# EasyEDA Pro project ConversorBUCK.eprj

# Schematic CIRCUITO
Board Name: Board1; Create Date: 2026-05-22; Page Name: P1; Project Name: ConversorBUCK; Schematic Name: CIRCUITO; Update Date: 2026-06-01; Company: EasyEDA.com; Page Size: A4; Version: V1.0
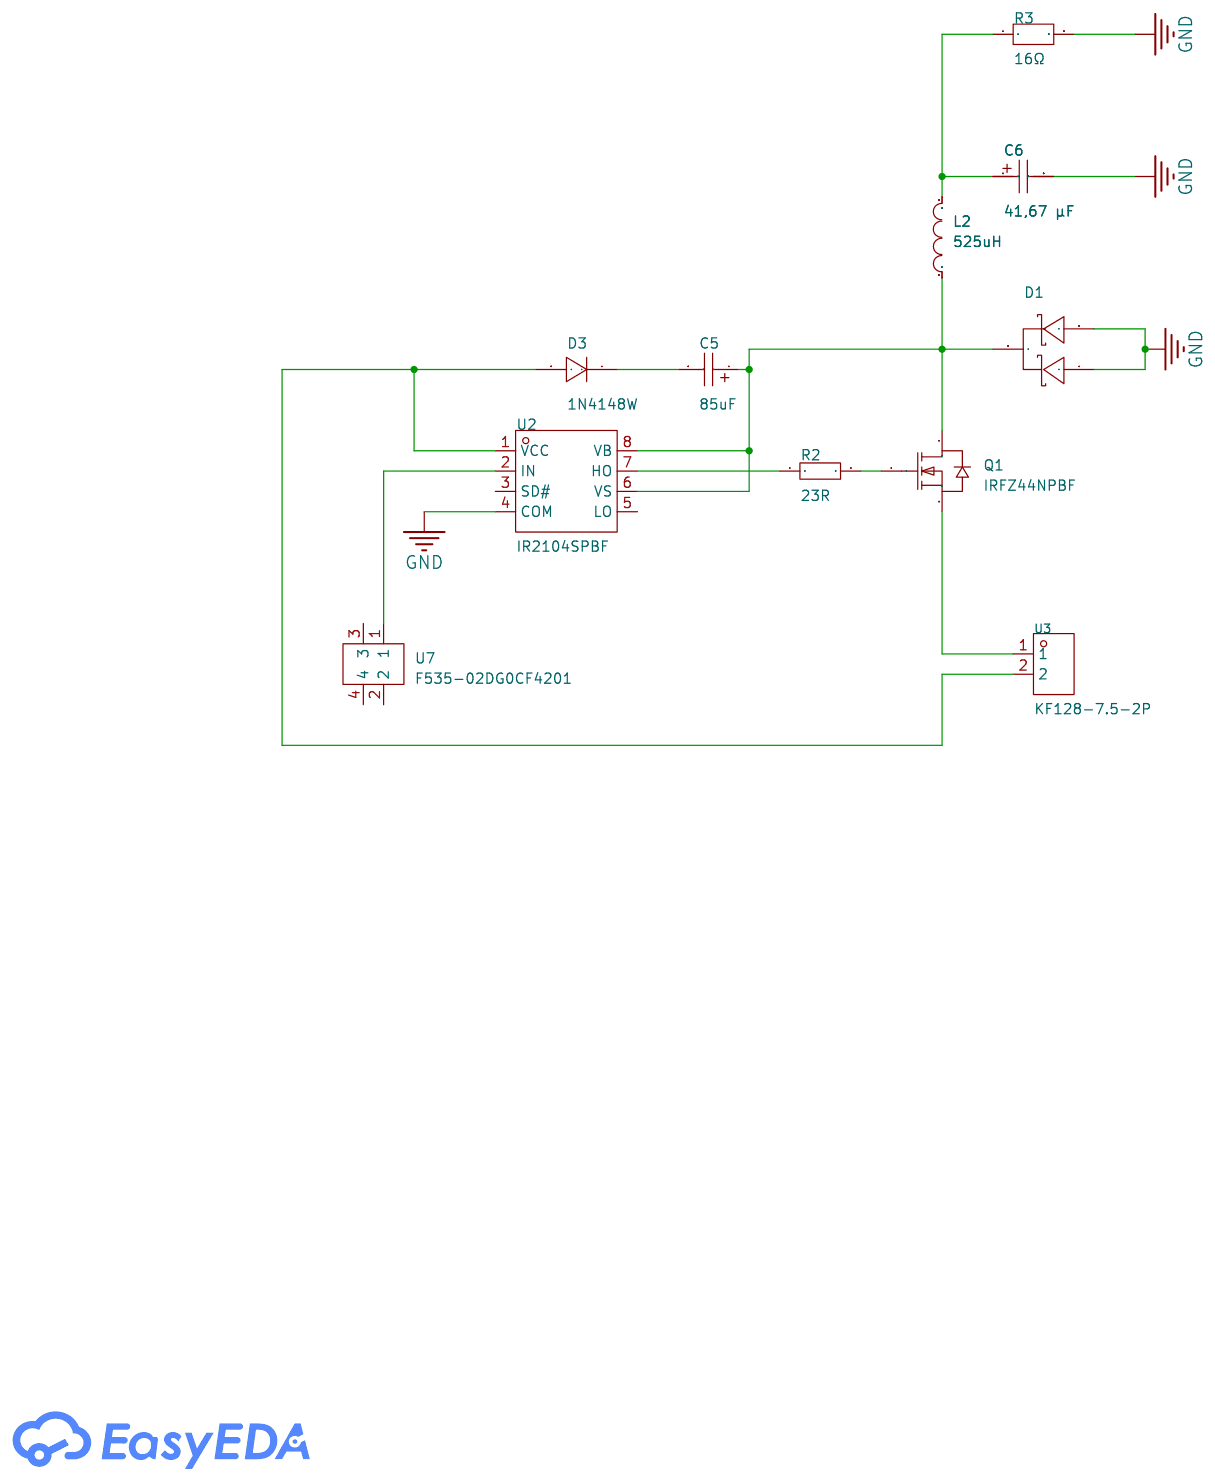
[diagram p0: schematic sheet]

## Parts
C5  85uF  [CAP-SMD_BD4.0-L4.3-W4.3-FD]
C6  41,67 µF  [CAP-SMD_BD4.0-L4.3-W4.3-FD]
D1  MBR2045CT  [TO-220AB-3_L10.4-W4.6-P2.54-T]
D3  1N4148W  [SOD-123F_L2.7-W1.6-LS3.8-RD]
L2  525uH  [L1206]
Q1  IRFZ44NPBF  [TO-220AB-3_L10.4-W4.6-P2.54-L]
R2  23R  [R0603]
R3  16Ω  [RES-TH_L20.3-W19.0-P27.00_AHA10]
U2  IR2104SPBF  [SOIC-8_L4.9-W3.9-P1.27-LS6.0-BL]
U3  KF128-7.5-2P  [CONN-TH_P7.50_KF128-7.5-2P]
U7  F535-02DG0CF4201  [HDR-TH_4P-P2.54-V-F-R2-C2-S2.54]

## Library data of the parts
C5 C6 = C_Ele_SMD_4x5.5mm: Supplier Footprint: SMD,4x5.5mm
D1 = MBR2045CT: LCSC Part Name: 电压:45V 电流:10A; Supplier Part: C360496; Manufacturer: PINGWEI(平伟); Supplier Footprint: TO-220AB-3; JLCPCB Part Class: Extended Part; Datasheet: https://atta.szlcsc.com/upload/public/pdf/source/20190312/C360496_49B2B343CB996FDDA607335F051EE626.pdf; Supplier: LCSC; Diode Configuration: Dual Common Cathode; Forward Voltage (Vf@If): 560mV@10A; Reverse Voltage (Vr): 45V; Average Rectified Current (Io): 10A; Reverse Leakage Current (Ir): 250uA@45V
D3 = 1N4148W_C81598: Supplier Part: C81598; Manufacturer: ST(先科); Supplier Footprint: SOD-123; JLCPCB Part Class: Basic Part; Datasheet: https://item.szlcsc.com/datasheet/1N4148W/82750.html; Supplier: LCSC; Diode Configuration: Independent; Voltage - Forward(Vf@If): 1V@50mA; Voltage - DC Reverse(Vr): 75V; Current - Rectified: 150mA; Pd - Power Dissipation: 400mW; Reverse Leakage Current (Ir): 1uA@75V; Reverse Recovery Time (trr): 4ns; Non-Repetitive Peak Forward Surge Current: 1A
L2 = L_1206
Q1 = IRFZ44NPBF_C3290502: LCSC Part Name: 1个N沟道 耐压:55V 电流:49A; Supplier Part: C3290502; Manufacturer: Infineon(英飞凌); Supplier Footprint: TO-220AB; JLCPCB Part Class: Extended Part; Supplier: LCSC; Type: 1个NChannel; Gate Threshold Voltage (Vgs(th)@Id): 4V@250uA; Total Gate Charge (Qg@Vgs): 63nC@10V; Input Capacitance (Ciss@Vds): 1.47nF@25V; Operating Temperature: -55℃~+175℃@(Tj)
R2 = Res_0603: Supplier Footprint: 0603
R3 = AHA10BJB-16R: Supplier Part: C1569365; Manufacturer: YAGEO(国巨); Supplier Footprint: 插件; JLCPCB Part Class: Extended Part; Datasheet: https://atta.szlcsc.com/upload/public/pdf/source/20200415/C513695_7344A335BE5724A12F7E0092D65755CC.pdf; Supplier: LCSC; Type: Wirewound Resistors; Tolerance: ±5%; Power(Watts): 100W; Temperature Coefficient: ±200ppm/℃
U2 = IR2104SPBF_C5204801: LCSC Part Name: 停产 IR2104SPBF; Supplier Part: C5204801; Manufacturer: Infineon(英飞凌); Supplier Footprint: SOIC-8; JLCPCB Part Class: Extended Part; Datasheet: https://item.szlcsc.com/datasheet/IR2104SPBF/5895015.html; Supplier: LCSC; Load Type: MOSFET；IGBT; Current - Output Low(IOL): 270mA; Current - Output High(IOH): 130mA; Voltage - Supply: 10V~20V; Rise Time: 100ns; Fall Time: 50ns
U3 = KF128-7.5-2P: LCSC Part Name: 1x2P 7.5mm 直插 排数:1 每排P数:2; Supplier Part: C474954; Manufacturer: KEFA(科发); Supplier Footprint: 插件,P=7.5mm; JLCPCB Part Class: Extended Part; Datasheet: https://item.szlcsc.com/datasheet/KF128-7.5-2P/481572.html; Supplier: LCSC; Number of Positions or Pins: 1x2P; Pitch: 7.5mm; Color: Green; Mounting Type: Through Hole; Number of Pins: 2P; Number of Rows: 1; Number of PINs Per Row: 2; Current Rating: 24A; Voltage Rating (Max): 450V; Wire Gauge - AWG: 12~22; Wire Gauge - mm2: 2.5; Operating Temperature: -40℃~+105℃
U7 = F535-02DG0CF4201: Supplier Part: C9900174314; Supplier Footprint: 2.54 female header 3.55 2*2P; JLCPCB Part Class: Extended Part; Supplier: LCSC

## Nets
GND: C6.2 D1.1(A) D1.3(A) R3.2 U2.4(COM)
$1N2076: C6.1 L2.2 R3.1
$1N3351: R2.1 U2.7(HO)
$1N3354: D3.2(A) U2.1(VCC) U3.2
$1N3356: C5.2 D3.1(K)
$1N3386: Q1.1(G) R2.2
$1N3409: C5.1 D1.2(K) L2.1 Q1.2(D) U2.6(VS) U2.8(VB)
$1N3529: Q1.3(S) U3.1
$1N3802: U2.2(IN) U7.1

Not connected (* = marked no-connect by the designer): U2 3(SD#) 5(LO); U7 2 3 4

# Schematic GATEDRIVE
Board Name: PCB3; Create Date: 2026-05-26; Page Name: P1; Project Name: ConversorBUCK; Schematic Name: GATEDRIVE; Update Date: 2026-05-26; Company: EasyEDA.com; Page Size: A4; Version: V1.0
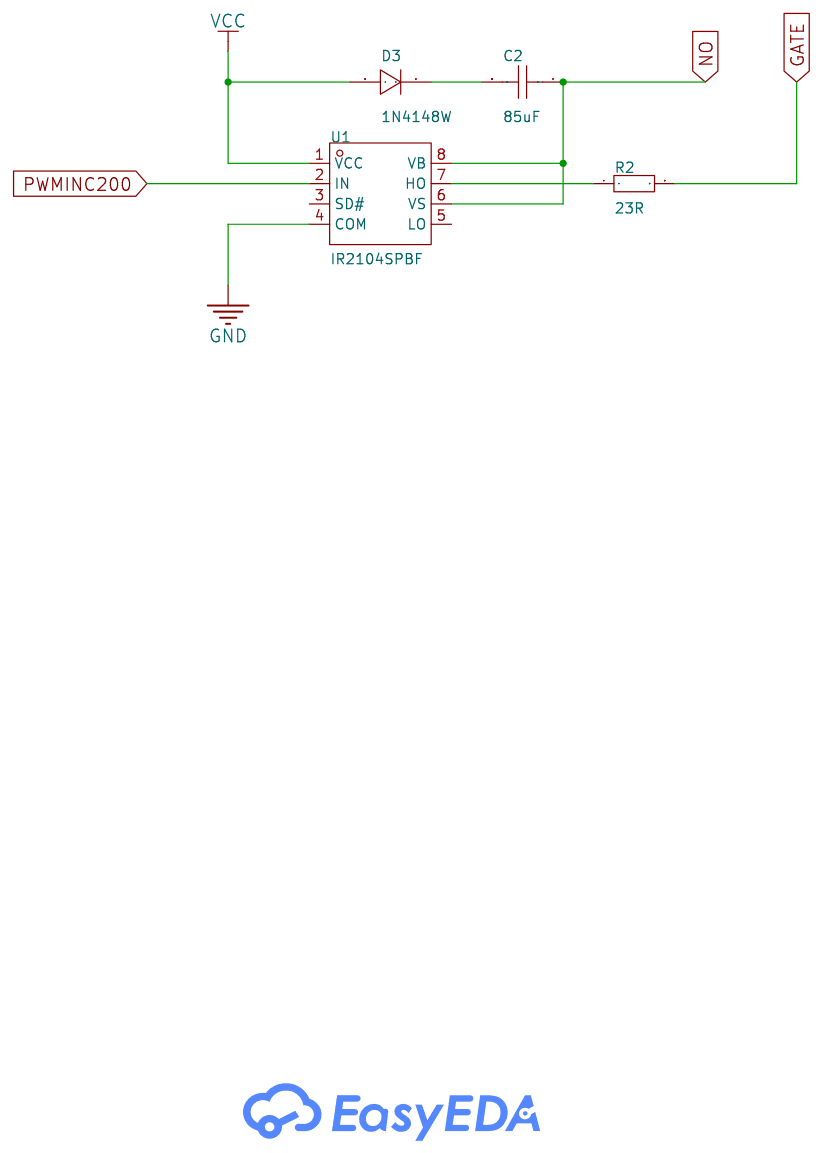
[diagram p1: schematic sheet]

## Parts
C2  85uF  [C0201]
D3  1N4148W  [SOD-123F_L2.7-W1.6-LS3.8-RD]
R2  23R  [R0603]
U1  IR2104SPBF  [SOIC-8_L4.9-W3.9-P1.27-LS6.0-BL]

## Library data of the parts
C2 = CAP_0201: Supplier Footprint: 0201
D3 = 1N4148W_C81598: Supplier Part: C81598; Manufacturer: ST(先科); Supplier Footprint: SOD-123; JLCPCB Part Class: Basic Part; Datasheet: https://item.szlcsc.com/datasheet/1N4148W/82750.html; Supplier: LCSC; Diode Configuration: Independent; Voltage - Forward(Vf@If): 1V@50mA; Voltage - DC Reverse(Vr): 75V; Current - Rectified: 150mA; Pd - Power Dissipation: 400mW; Reverse Leakage Current (Ir): 1uA@75V; Reverse Recovery Time (trr): 4ns; Non-Repetitive Peak Forward Surge Current: 1A
R2 = Res_0603: Supplier Footprint: 0603
U1 = IR2104SPBF_C5204801: LCSC Part Name: 停产 IR2104SPBF; Supplier Part: C5204801; Manufacturer: Infineon(英飞凌); Supplier Footprint: SOIC-8; JLCPCB Part Class: Extended Part; Datasheet: https://item.szlcsc.com/datasheet/IR2104SPBF/5895015.html; Supplier: LCSC; Load Type: MOSFET；IGBT; Current - Output Low(IOL): 270mA; Current - Output High(IOH): 130mA; Voltage - Supply: 10V~20V; Rise Time: 100ns; Fall Time: 50ns

## Nets
GND: U1.4(COM)
VCC: D3.2(A) U1.1(VCC)
GATE: R2.2
NO: C2.1 U1.6(VS) U1.8(VB)
PWMINC200: U1.2(IN)
$1N239: C2.2 D3.1(K)
$1N241: R2.1 U1.7(HO)

Not connected (* = marked no-connect by the designer): U1 3(SD#) 5(LO)

# Board PCB2
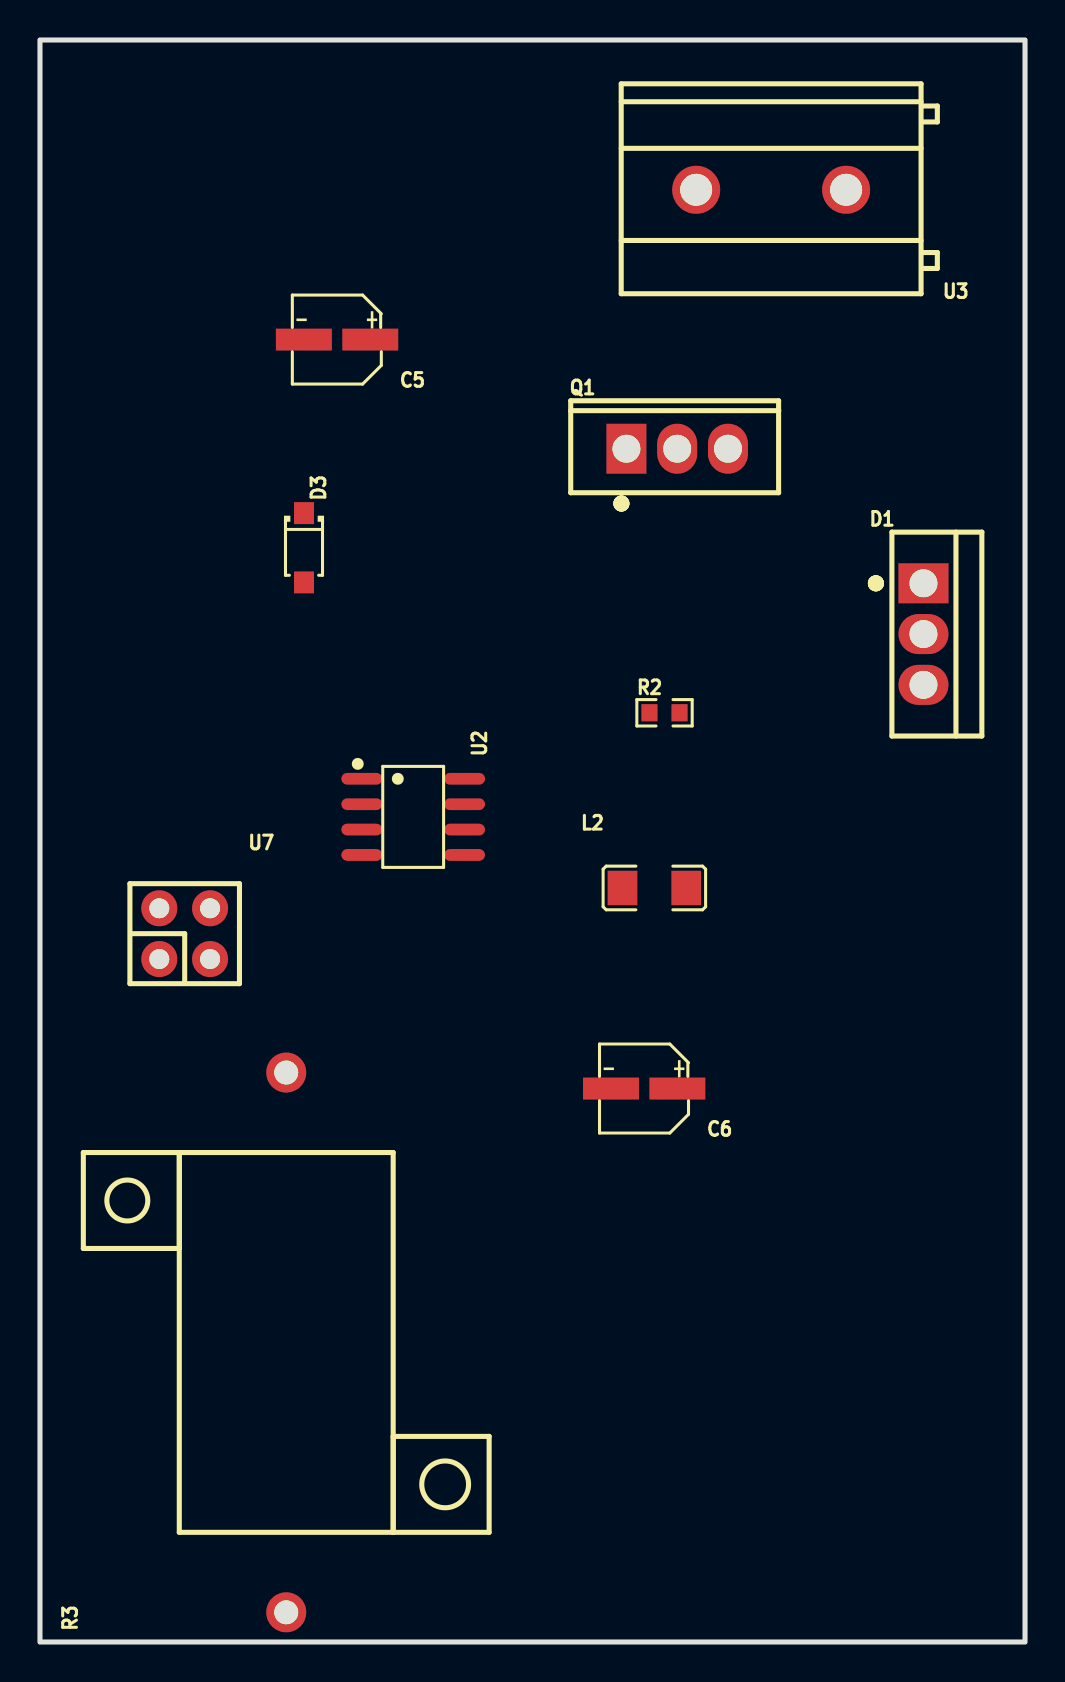
[diagram p2: board, top side]
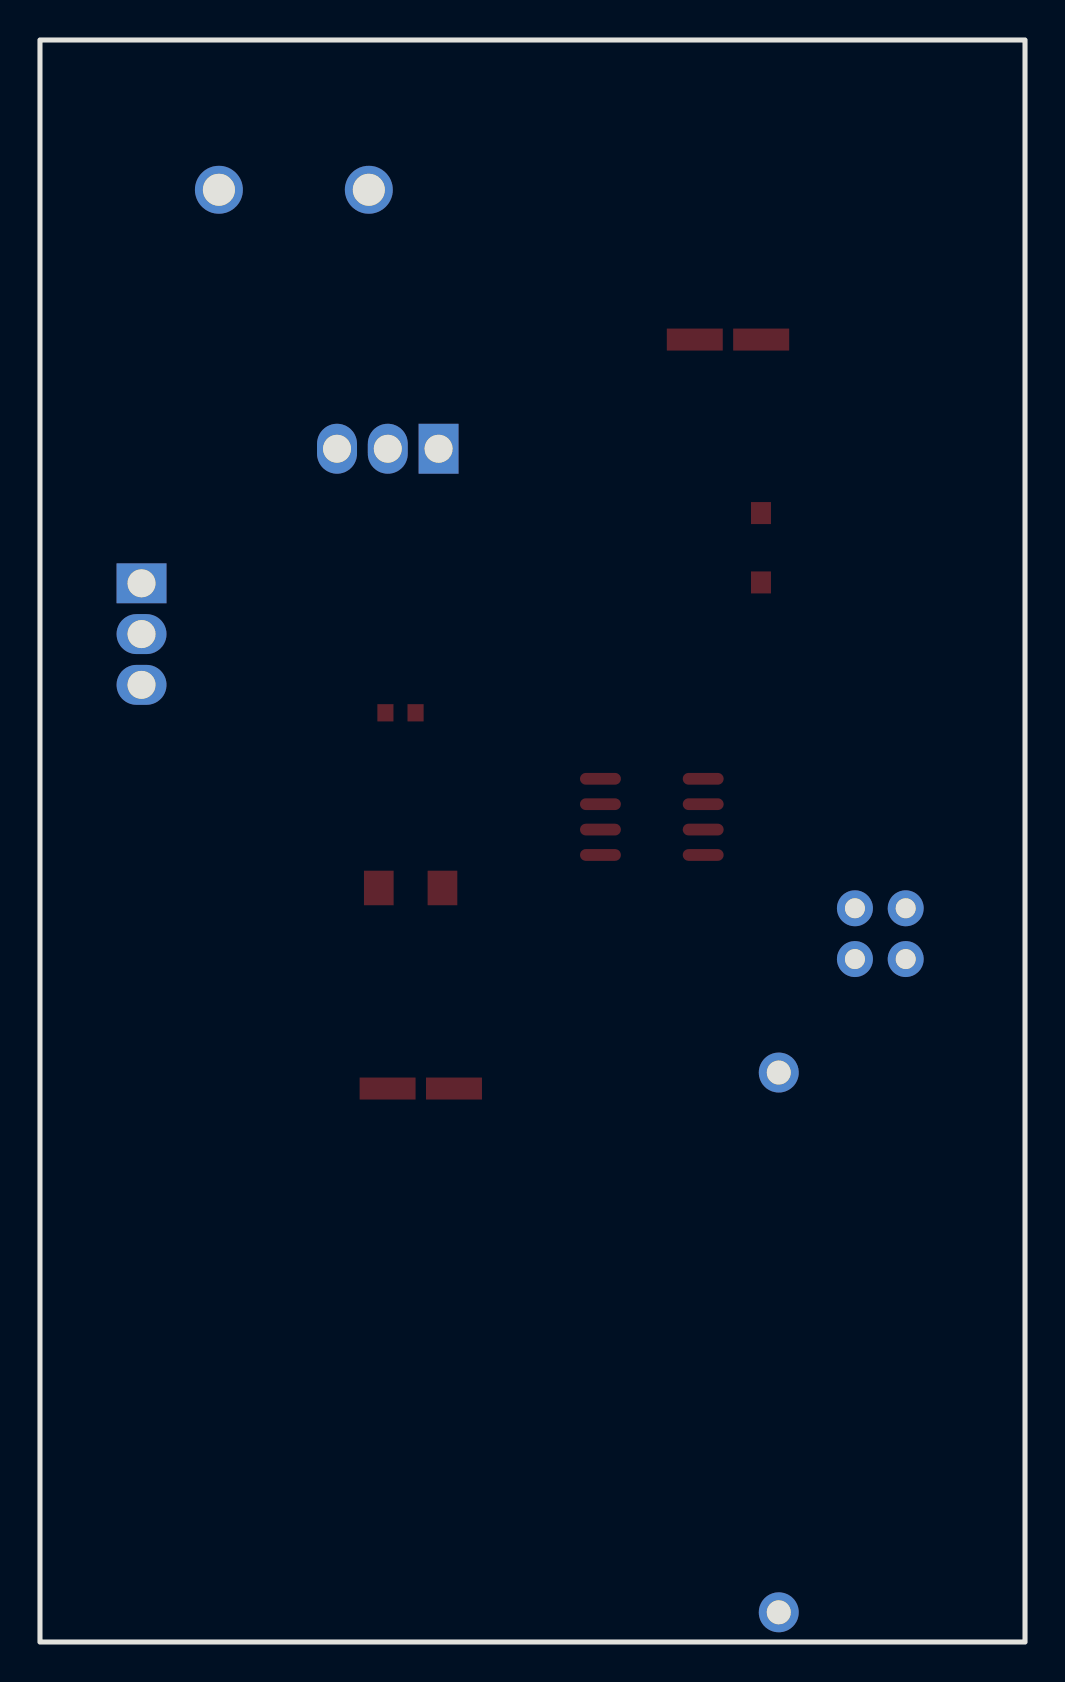
[diagram p3: board, bottom side, seen from below]

Outline 49.28 x 80.14 mm; copper layers: Top Layer, Bottom Layer. Coordinates in mm from the lower left corner of the outline.
Outline path: rectangle 0,80.14 49.28,0
Stack: Top Layer 0.035mm / Dielectric1 1.51mm FR4 er 4.5 / Bottom Layer 0.035mm

## Design rules (mm)
template: JLCPCB Capability(Two Layers Board)
spacing copperThickness1oz (default): track to track 0.102, other pairs 0.152 to 0.3
spacing copperThickness2oz: track to track 0.203, other pairs 0.152 to 0.3
track width copperThickness1oz (default): min 0.127, default 0.254, max 2.54
track width copperThickness2oz: min 0.203, default 0.254, max 2.54
differential pair differentialPair (default): width min 0.127, default 0.254, max 2.54; gap min 0.152, default 0.152
via viaSize (default): diameter min 0.5, default 0.61, max 10; hole min 0.3, default 0.305, max 6.3

## Placement (name value [footprint] x y rotation side)
C5  85uF  [CAP-SMD_BD4.0-L4.3-W4.3-FD]  14.86 65.15 180 top
C6  41,67 µF  [CAP-SMD_BD4.0-L4.3-W4.3-FD]  30.23 27.69 180 top
D1  MBR2045CT  [TO-220AB-3_L10.4-W4.6-P2.54-T]  44.2 50.42 0 top
D3  1N4148W  [SOD-123F_L2.7-W1.6-LS3.8-RD]  13.21 54.74 270 top
L2  525uH  [L1206]  30.73 37.72 0 top
Q1  IRFZ44NPBF  [TO-220AB-3_L10.4-W4.6-P2.54-L]  31.88 59.69 0 top
R2  23R  [R0603]  31.24 46.48 0 top
R3  16Ω  [RES-TH_L20.3-W19.0-P27.00_AHA10]  12.32 14.99 90 top
U2  IR2104SPBF  [SOIC-8_L4.9-W3.9-P1.27-LS6.0-BL]  18.67 41.27 270 top
U3  KF128-7.5-2P  [CONN-TH_P7.50_KF128-7.5-2P]  36.58 72.64 180 top
U7  F535-02DG0CF4201  [HDR-TH_4P-P2.54-V-F-R2-C2-S2.54]  7.24 35.43 0 top

## Footprints (pads in the part's own frame, mm; a bottom-side part is the same pattern mirrored in y, then rotated)
CAP-SMD_BD4.0-L4.3-W4.3-FD
  rect 2.8x1.1 smd: 1(-1.661,0) 2(1.661,0)
CONN-TH_P7.50_KF128-7.5-2P
  round 2.4 hole 1.6: 1(-3.75,0) 2(3.75,0)
HDR-TH_4P-P2.54-V-F-R2-C2-S2.54
  round 1.8 hole 1: 1(-1.27,-1.27) 2(-1.27,1.27) 3(1.27,-1.27) 4(1.27,1.27)
L1206
  rect 1.485x1.728 smd: 1(-1.593,0) 2(1.593,0)
R0603
  rect 0.806x0.864 smd: 1(-0.753,0) 2(0.753,0)
RES-TH_L20.3-W19.0-P27.00_AHA10
  round 2 hole 1.2: 1(-13.5,0) 2(13.5,0)
SOD-123F_L2.7-W1.6-LS3.8-RD
  rect 1.1x1 smd: 1(-1.735,0) 2(1.735,0)
SOIC-8_L4.9-W3.9-P1.27-LS6.0-BL
  oval 0.588x2.045 smd: 1(-1.905,-2.57) 2(-0.635,-2.57) 3(0.635,-2.57) 4(1.905,-2.57) 5(1.905,2.57) 6(0.635,2.57) 7(-0.635,2.57) 8(-1.905,2.57)
TO-220AB-3_L10.4-W4.6-P2.54-L
  rect 2x2.5 hole 1.4: 1(-2.54,0)
  oval 2x2.5 hole 1.4: 2(0,0) 3(2.54,0)
TO-220AB-3_L10.4-W4.6-P2.54-T
  rect 2.5x2 hole 1.4: 1(0,2.54)
  oval 2.5x2 hole 1.4: 2(0,0) 3(0,-2.54)

## Nets
As in the schematic.

Pads without a net: U2 3 5; U7 2 3 4

# Board PCB3
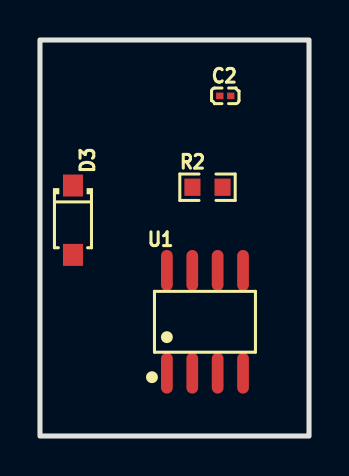
[diagram p4: board, top side]
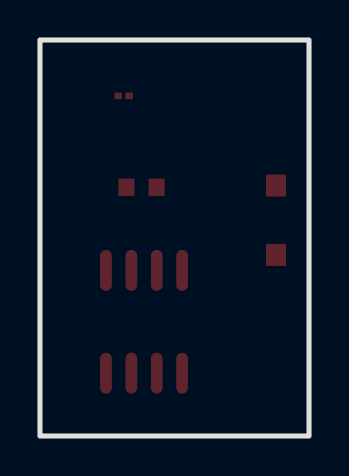
[diagram p5: board, bottom side, seen from below]

Outline 13.46 x 19.81 mm; copper layers: Top Layer, Bottom Layer. Coordinates in mm from the lower left corner of the outline.
Outline path: rectangle 0,19.81 13.46,0
Stack: Top Layer 0.035mm / Dielectric1 1.51mm FR4 er 4.5 / Bottom Layer 0.035mm

## Design rules (mm)
template: JLCPCB Capability(Two Layers Board)
spacing copperThickness1oz (default): track to track 0.102, other pairs 0.152 to 0.3
spacing copperThickness2oz: track to track 0.203, other pairs 0.152 to 0.3
track width copperThickness1oz (default): min 0.127, default 0.254, max 2.54
track width copperThickness2oz: min 0.203, default 0.254, max 2.54
differential pair differentialPair (default): width min 0.127, default 0.254, max 2.54; gap min 0.152, default 0.152
via viaSize (default): diameter min 0.5, default 0.61, max 10; hole min 0.3, default 0.305, max 6.3

## Placement (name value [footprint] x y rotation side)
C2  85uF  [C0201]  9.27 17.02 0 top
D3  1N4148W  [SOD-123F_L2.7-W1.6-LS3.8-RD]  1.65 10.8 270 top
R2  23R  [R0603]  8.38 12.45 0 top
U1  IR2104SPBF  [SOIC-8_L4.9-W3.9-P1.27-LS6.0-BL]  8.25 5.72 0 top

## Footprints (pads in the part's own frame, mm; a bottom-side part is the same pattern mirrored in y, then rotated)
C0201
  rect 0.368x0.324 smd: 1(-0.275,0) 2(0.275,0)
R0603
  rect 0.806x0.864 smd: 1(-0.753,0) 2(0.753,0)
SOD-123F_L2.7-W1.6-LS3.8-RD
  rect 1.1x1 smd: 1(-1.735,0) 2(1.735,0)
SOIC-8_L4.9-W3.9-P1.27-LS6.0-BL
  oval 0.588x2.045 smd: 1(-1.905,-2.57) 2(-0.635,-2.57) 3(0.635,-2.57) 4(1.905,-2.57) 5(1.905,2.57) 6(0.635,2.57) 7(-0.635,2.57) 8(-1.905,2.57)

## Nets
As in the schematic.

Pads without a net: U1 3 5
